# EAGLE design Practicum (EAGLE 9.5.1)
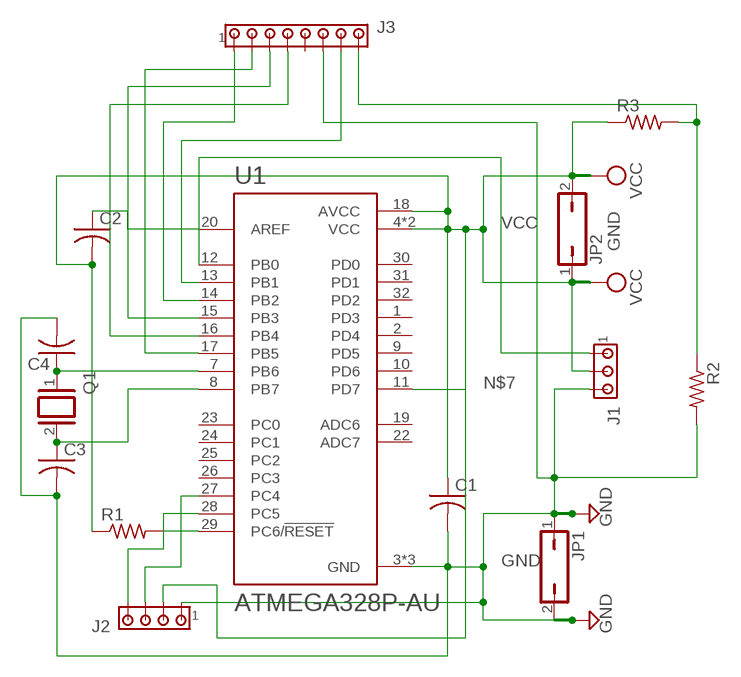
[diagram p0: schematic, sheet 1]

## Parts
C1  C-USC0603  [C0603]
C2  C-USC0603  [C0603]
C3  C-USC0603  [C0603]
C4  C-USC0603  [C0603]
J1  MTA03-100  [10X03MTA]
J2  MTA04-100  [10X04MTA]
J3  MTA08-100  [10X08MTA]
JP1  JP1Q  [JP1]
JP2  JP1Q  [JP1]
Q1  XTAL/S  [QS]
R1  R-US_R0603  [R0603]
R2  R-US_R0603  [R0603]
R3  R-US_R0603  [R0603]
U1  ATMEGA328P-AU  [QFP80P900X900X120-32N]

## Nets
GND: C1.2 C3.2 C4.2 J1.3 J2.1 J3.6 JP1.1 JP1.2 R2.2 U1.3(GND) U1.5(GND) U1.21(GND)
N$1: C4.1 Q1.1 U1.7(PB6)
N$2: C3.1 Q1.2 U1.8(PB7)
N$3: J3.3 U1.15(PB3)
N$4: R1.2 U1.29(PC6/!RESET)
N$5: J3.4 U1.16(PB4)
N$6: C2.1 U1.20(AREF)
N$7: U1.11(PD7)
N$8: J3.7 U1.13(PB1)
N$9: J2.3 U1.27(PC4)
N$10: J2.4 U1.28(PC5)
N$11: J1.1 U1.12(PB0)
N$12: J3.1 U1.14(PB2)
N$13: J3.8 R2.1 R3.2
N$14: J3.2 U1.17(PB5)
VCC: C1.1 C2.2 J1.2 J2.2 JP2.1 JP2.2 R1.1 R3.1 U1.4(VCC) U1.6(VCC) U1.18(AVCC)
Unconnected: J3.5 U1.1(PD3) U1.2(PD4) U1.9(PD5) U1.10(PD6) U1.19(ADC6) U1.22(ADC7) U1.23(PC0) U1.24(PC1) U1.25(PC2) U1.26(PC3) U1.30(PD0) U1.31(PD1) U1.32(PD2)

## Notes on the sheet
- GND

## Library data of the parts
C1-C4 = rcl:C-US: CAPACITOR, American symbol; SPICEPREFIX: C
J1 = con-amp:MTA03-100: AMP connector
J2 = con-amp:MTA04-100: AMP connector
J3 = con-amp:MTA08-100: AMP connector
JP1 JP2 = jumper:JP1Q: JUMPER
Q1 = special:XTAL/S: CRYSTAL
R1-R3 = rcl:R-US_: RESISTOR, American symbol; SPICEPREFIX: R
U1 = ATMEGA328P-AU:ATMEGA328P-AU: ATmega Series 20 MHz 32 KB Flash 2 KB SRAM 8-Bit Microcontroller - TQFP-32; AVAILABILITY: Unavailable; DESCRIPTION: Microcontroller Mcu, 8 Bit, Atmega, 20mhz, Tqfp-32; MF: Microchip; MP: ATMEGA328P-AU; PACKAGE: TQFP-32 Microchip; PRICE: None

## Board
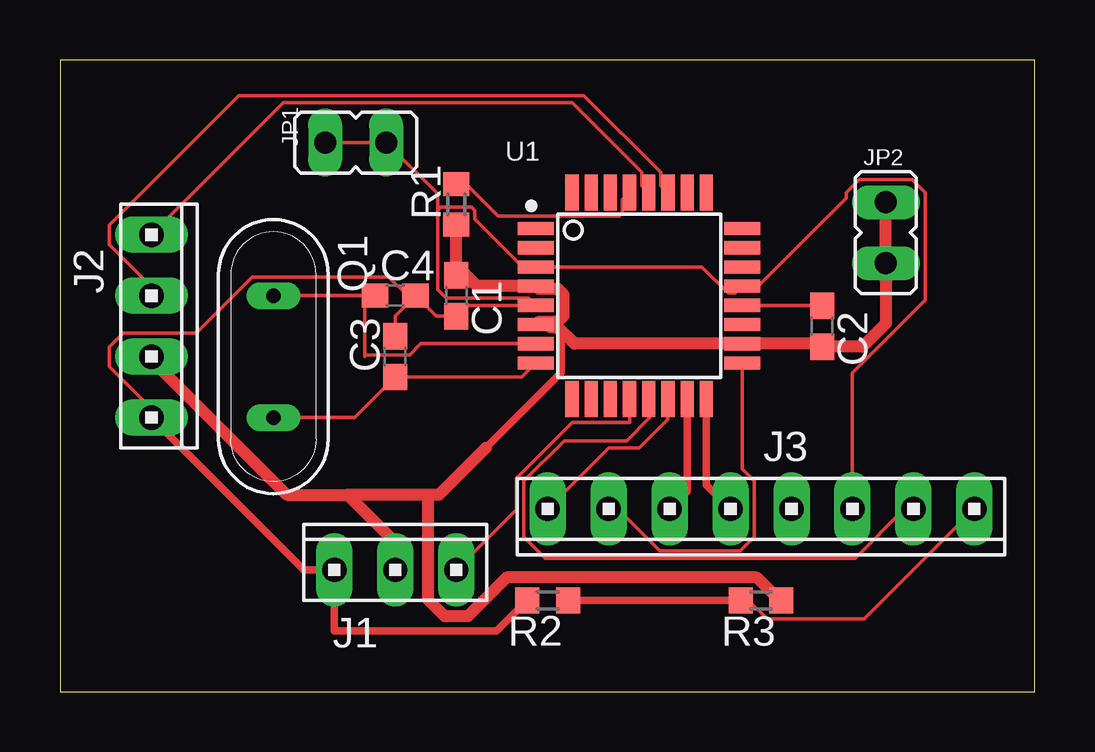
[diagram p1: board, top side]

Size 40.62 x 26.34 mm. Coordinates in mm from the lower left corner, seen from the top.
Outline: 0,0 40.62,0 40.62,26.34 0,26.34 0,0
Copper layers (1*16): Top 0.035mm / dielectric 1.5mm / Bottom 0.035mm
Design rules "default": minimum track width 6mil, minimum drill 0.35mm, track to track 6mil, track to pad 6mil, pad to pad 6mil, via to via 6mil, smd to smd 6mil, copper to edge 40mil, drill to drill 6mil, minimum pad ring 10mil, minimum via ring 8mil, stop-mask expansion 4mil, vias tented up to drill 0mil, thermal gap 10mil

### Footprints (pad centres in the part's own frame; a part is rotated, then mirrored left to right if it is on the bottom)
C0603 = smd 1.1 x 1: 1 -0.85,0; 2 0.85,0
10X03MTA = drill 1.016 long: 1 2.54,0; 2 0,0; 3 -2.54,0
10X04MTA = drill 1.016 long: 1 3.81,0; 2 1.27,0; 3 -1.27,0; 4 -3.81,0
10X08MTA = drill 1.016 long: 1 8.89,0; 2 6.35,0; 3 3.81,0; 4 1.27,0; 5 -1.27,0; 6 -3.81,0; 7 -6.35,0; 8 -8.89,0
JP1 = drill 0.914 long: 1 0,-1.27; 2 0,1.27
QS = drill 0.61 long: 1 -2.54,0; 2 2.54,0
R0603 = smd 1 x 1.1: 1 -0.85,0; 2 0.85,0
QFP80P900X900X120-32N = smd 1.5 x 0.55: 1 -4.3,2.8; 2 -4.3,2; 3 -4.3,1.2; 4 -4.3,0.4; 5 -4.3,-0.4; 6 -4.3,-1.2; 7 -4.3,-2; 8 -4.3,-2.8; 17 4.3,-2.8; 18 4.3,-2; 19 4.3,-1.2; 20 4.3,-0.4; 21 4.3,0.4; 22 4.3,1.2; 23 4.3,2; 24 4.3,2.8 | smd 0.55 x 1.5: 9 -2.8,-4.3; 10 -2,-4.3; 11 -1.2,-4.3; 12 -0.4,-4.3; 13 0.4,-4.3; 14 1.2,-4.3; 15 2,-4.3; 16 2.8,-4.3; 25 2.8,4.3; 26 2,4.3; 27 1.2,4.3; 28 0.4,4.3; 29 -0.4,4.3; 30 -1.2,4.3; 31 -2,4.3; 32 -2.8,4.3

### Placement (x,y rotation side)
C1  16.51,16.51 270 top
C2  31.75,15.24 270 top
C3  13.97,13.97 90 top
C4  13.97,16.51 0 top
J1  13.97,5.08 0 top
J2  3.81,15.24 270 top
J3  29.21,7.62 180 top
JP1  12.32,22.9 270 top
JP2  34.41,19.14 0 top
Q1  8.89,13.97 270 top
R1  16.51,20.32 90 top
R2  20.32,3.81 180 top
R3  29.21,3.81 180 top
U1  24.13,16.51 0 top

### Tracks (layer width: path | path; a pad name or v marks a point on that pad's centre or on a via)
GND
  Top 0.152: JP1.1 JP1.2 15.73,20.76 15.73,20.07 | C4.2 15.67,15.66 C1.2 16.96,16.11 U1.5 19.53,16.41 16.09,16.41 15.73,16.77 15.73,20.07 | C4.2 13.97,15.66 C3.2 | 15.73,20.07 15.87,20.2 17.16,20.2 17.29,20.07 17.29,19.7 19.28,17.71 U1.3 26.74,17.71 27.84,16.61 28.13,16.61 U1.21 28.81,16.91 28.95,16.77 32.76,20.58 32.76,20.8 33.31,21.35 35.51,21.35 36.06,20.8 36.06,16.33 33.02,13.29 J3.6 | J2.1 3.81,11.81 2.06,13.56 2.06,14.38 2.64,14.96 5.67,14.96 8.01,17.3 13.71,17.3 14.49,16.51 C4.2
  Top 0.305: J2.1 10.16,5.08 J1.3 11.43,2.54 18.2,2.54 R2.2
N$1
  Top 0.152: U1.7 15.03,14.51 14.56,14.04 12.77,14.04 12.7,13.97 12.7,16.09 C4.1 Q1.1
N$2
  Top 0.152: U1.8 19.24,13.12 C3.1 12.28,11.43 Q1.2
N$3
  Top 0.305: J3.3 26.13,8.35 U1.15
N$4
  Top 0.152: R1.2 16.72,21.38 18.27,19.83 23.3,19.83 23.43,19.96 23.43,20.51 U1.29
N$5
  Top 0.305: J3.4 26.93,8.63 U1.16
N$6
  Top 0.152: U1.20 31.73,16.11 C2.1
N$8
  Top 0.152: 24.57,12.26 24.57,11.43 23.61,10.46 21,10.46 19.33,8.79 19.33,6.45 20.21,5.56 33.13,5.56 35.18,7.62 J3.7
  Top 0.305: 24.57,12.26 U1.13
N$9
  Top 0.152: U1.27 25.03,21.11 25.03,21.66 21.83,24.86 7.45,24.86 2.06,19.46 2.06,18.64 3.81,16.89 J2.3
N$10
  Top 0.152: U1.28 24.23,21.11 24.23,21.66 21.34,24.55 9.31,24.55 J2.4
N$11
  Top 0.152: U1.12 23.73,11.23 21.34,11.23 19.02,8.92 19.02,7.59 J1.1
N$12
  Top 0.152: J3.1 22.86,10.16 24.13,10.16 25.33,11.36 U1.14
N$13
  Top 0.152: 27.94,3.81 28.69,3.81 29.46,3.03 33.51,3.03 J3.8
  Top 0.305: R3.2 27.94,3.81 R2.1
N$14
  Top 0.152: U1.17 28.43,9.29 28.93,8.79 28.93,6.45 28.35,5.87 24.99,5.87 23.24,7.62 J3.2
VCC
  Top 0.152: U1.6 20.32,15.31 20.62,15.61 20.68,15.61 20.81,15.74 20.81,16.48 20.68,16.61 20.13,16.61 U1.4 16.96,16.91 C1.1 16.51,17.78 16.51,19.05 R1.1
  Top 0.305: 20.75,15.43 20.75,15.19 20.75,15.05 20.89,14.91 20.89,13.31 17.76,10.18
  Top 0.508: JP2.2 JP2.1 34.41,15.36 33.44,14.39 C2.2 31.63,14.51 U1.18 21.43,14.51 20.75,15.19 20.44,15.19 20.32,15.31 | U1.6 19.95,15.43 20.75,15.43 20.99,15.67 20.99,16.55 20.75,16.79 19.95,16.79 U1.4 17.38,16.91 16.51,17.78 | C1.1 16.51,19.05 | J1.2 13.97,6.22 11.99,8.21 | J2.2 3.81,13.84 9.45,8.21 11.99,8.21 | 17.76,10.18 15.78,8.21 15.24,8.21 | 15.24,8.21 11.99,8.21 | 15.24,8.21 15.34,8.1 15.34,3.83 16.03,3.15 16.99,3.15 18.61,4.77 29.03,4.77 29.98,3.81 R3.1